# EAGLE design input_output (EAGLE 9.3.0)
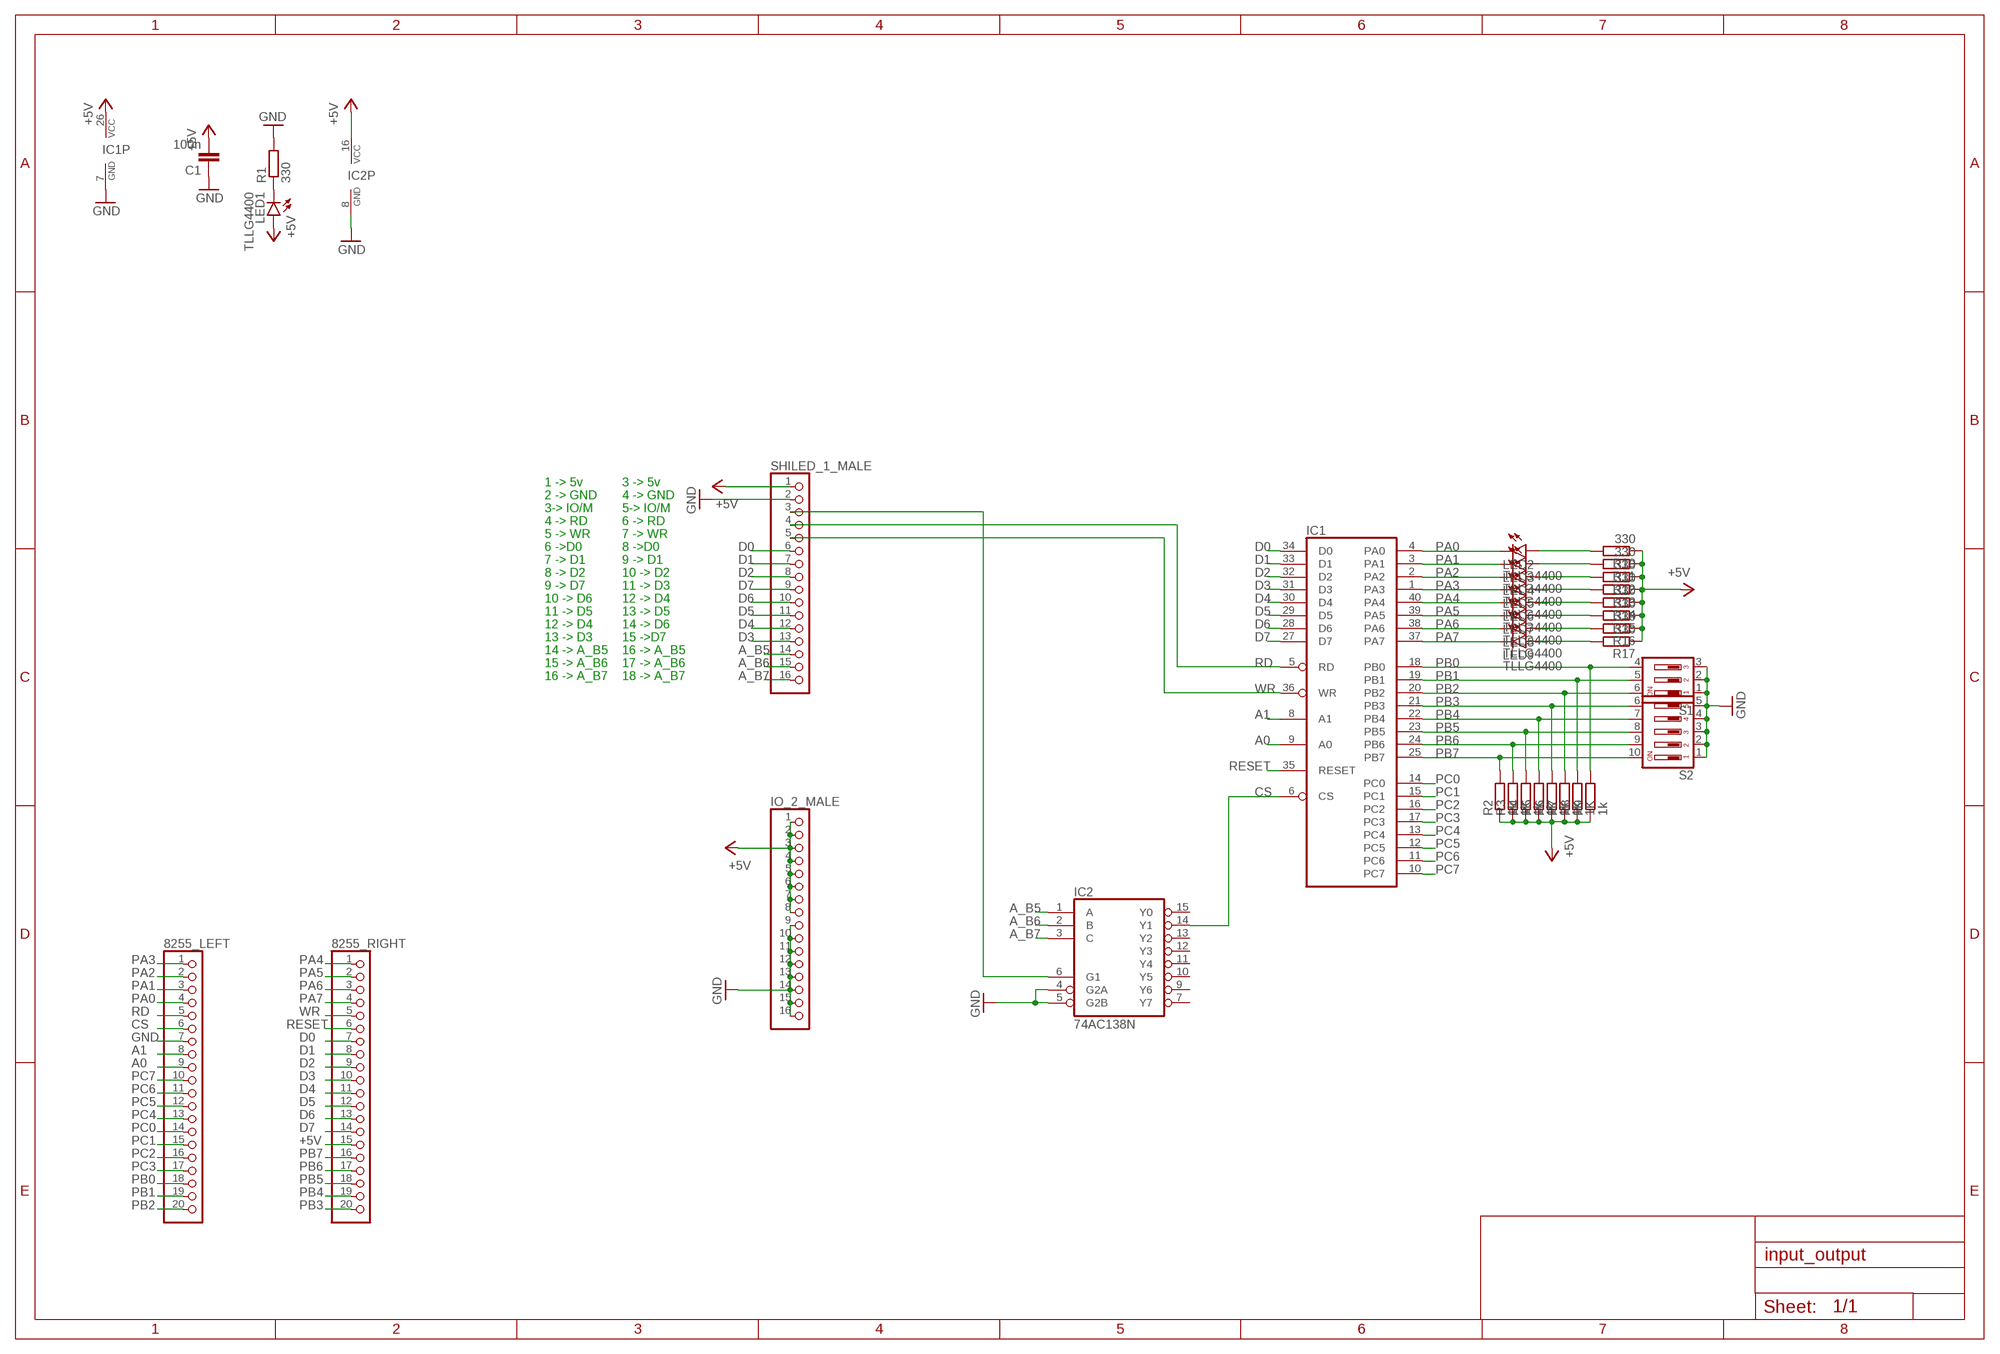
[diagram p0: schematic, sheet 1]

## Parts
8255_LEFT  PINHD-1X20  [1X20]
8255_RIGHT  PINHD-1X20  [1X20]
C1  100n  C-EU025-025X050  [C025-025X050]
IC1  8255A  [DIL40]
IC2  74AC138N  [DIL16]
IO_2_MALE  PINHD-1X16  [1X16]
LED1  TLLG4400  [LED3MM]
LED2  TLLG4400  [LED3MM]
LED3  TLLG4400  [LED3MM]
LED4  TLLG4400  [LED3MM]
LED5  TLLG4400  [LED3MM]
LED6  TLLG4400  [LED3MM]
LED7  TLLG4400  [LED3MM]
LED8  TLLG4400  [LED3MM]
LED9  TLLG4400  [LED3MM]
R1  330  R-EU_0207/7  [0207/7]
R2  1k  R-EU_0207/7  [0207/7]
R3  1k  R-EU_0207/7  [0207/7]
R4  1k  R-EU_0207/7  [0207/7]
R5  1k  R-EU_0207/7  [0207/7]
R6  1k  R-EU_0207/7  [0207/7]
R7  1k  R-EU_0207/7  [0207/7]
R8  1K  R-EU_0207/7  [0207/7]
R9  1k  R-EU_0207/7  [0207/7]
R10  330  R-EU_0207/7  [0207/7]
R11  330  R-EU_0207/7  [0207/7]
R12  330  R-EU_0207/7  [0207/7]
R13  330  R-EU_0207/7  [0207/7]
R14  330  R-EU_0207/7  [0207/7]
R15  330  R-EU_0207/7  [0207/7]
R16  330  R-EU_0207/7  [0207/7]
R17  330  R-EU_0207/7  [0207/7]
S1  DIP03YL  [DIP03YL]
S2  DIP05YL  [DIP05YL]
SHILED_1_MALE  PINHD-1X16  [1X16]

## Nets
+5V: 8255_RIGHT.15 C1.2 IC1.26(VCC) IC2.16(VCC) IO_2_MALE.1 IO_2_MALE.2 IO_2_MALE.3 IO_2_MALE.4 IO_2_MALE.5 IO_2_MALE.6 IO_2_MALE.7 IO_2_MALE.8 LED1.A R2.1 R3.1 R4.1 R5.1 R6.1 R7.1 R8.1 R9.1 R10.1 R11.1 R12.1 R13.1 R14.1 R15.1 R16.1 R17.1 SHILED_1_MALE.1
A0: 8255_LEFT.9 IC1.9(A0)
A1: 8255_LEFT.8 IC1.8(A1)
A_B5: IC2.1(A) SHILED_1_MALE.14
A_B6: IC2.2(B) SHILED_1_MALE.15
A_B7: IC2.3(C) SHILED_1_MALE.16
CS: 8255_LEFT.6 IC1.6(CS) IC2.14(Y1)
D0: 8255_RIGHT.7 IC1.34(D0) SHILED_1_MALE.6
D1: 8255_RIGHT.8 IC1.33(D1) SHILED_1_MALE.7
D2: 8255_RIGHT.9 IC1.32(D2) SHILED_1_MALE.8
D3: 8255_RIGHT.10 IC1.31(D3) SHILED_1_MALE.13
D4: 8255_RIGHT.11 IC1.30(D4) SHILED_1_MALE.12
D5: 8255_RIGHT.12 IC1.29(D5) SHILED_1_MALE.11
D6: 8255_RIGHT.13 IC1.28(D6) SHILED_1_MALE.10
D7: 8255_RIGHT.14 IC1.27(D7) SHILED_1_MALE.9
GND: 8255_LEFT.7 C1.1 IC1.7(GND) IC2.4(G2A) IC2.5(G2B) IC2.8(GND) IO_2_MALE.9 IO_2_MALE.10 IO_2_MALE.11 IO_2_MALE.12 IO_2_MALE.13 IO_2_MALE.14 IO_2_MALE.15 IO_2_MALE.16 R1.2 S1.1 S1.2 S1.3 S2.1 S2.2 S2.3 S2.4 S2.5 SHILED_1_MALE.2
N$1: LED1.K(C) R1.1
N$2: LED2.A R10.2
N$3: LED3.A R11.2
N$4: LED4.A R12.2
N$5: LED5.A R13.2
N$6: LED6.A R14.2
N$7: LED7.A R15.2
N$8: LED8.A R16.2
N$9: LED9.A R17.2
N$10: IC2.6(G1) SHILED_1_MALE.3
PA0: 8255_LEFT.4 IC1.4(PA0) LED2.K(C)
PA1: 8255_LEFT.3 IC1.3(PA1) LED3.K(C)
PA2: 8255_LEFT.2 IC1.2(PA2) LED4.K(C)
PA3: 8255_LEFT.1 IC1.1(PA3) LED5.K(C)
PA4: 8255_RIGHT.1 IC1.40(PA4) LED6.K(C)
PA5: 8255_RIGHT.2 IC1.39(PA5) LED7.K(C)
PA6: 8255_RIGHT.3 IC1.38(PA6) LED8.K(C)
PA7: 8255_RIGHT.4 IC1.37(PA7) LED9.K(C)
PB0: 8255_LEFT.18 IC1.18(PB0) R9.2 S1.4
PB1: 8255_LEFT.19 IC1.19(PB1) R8.2 S1.5
PB2: 8255_LEFT.20 IC1.20(PB2) R7.2 S1.6
PB3: 8255_RIGHT.20 IC1.21(PB3) R6.2 S2.6
PB4: 8255_RIGHT.19 IC1.22(PB4) R5.2 S2.7
PB5: 8255_RIGHT.18 IC1.23(PB5) R4.2 S2.8
PB6: 8255_RIGHT.17 IC1.24(PB6) R3.2 S2.9
PB7: 8255_RIGHT.16 IC1.25(PB7) R2.2 S2.10
PC0: 8255_LEFT.14 IC1.14(PC0)
PC1: 8255_LEFT.15 IC1.15(PC1)
PC2: 8255_LEFT.16 IC1.16(PC2)
PC3: 8255_LEFT.17 IC1.17(PC3)
PC4: 8255_LEFT.13 IC1.13(PC4)
PC5: 8255_LEFT.12 IC1.12(PC5)
PC6: 8255_LEFT.11 IC1.11(PC6)
PC7: 8255_LEFT.10 IC1.10(PC7)
RD: 8255_LEFT.5 IC1.5(RD) SHILED_1_MALE.4
RESET: 8255_RIGHT.6 IC1.35(RESET)
WR: 8255_RIGHT.5 IC1.36(WR) SHILED_1_MALE.5
Unconnected: IC2.7(Y7) IC2.9(Y6) IC2.10(Y5) IC2.11(Y4) IC2.12(Y3) IC2.13(Y2) IC2.15(Y0)

## Notes on the sheet
- 1 -> 5v | 3 -> 5v
- 2 -> GND | 4 -> GND
- 3-> IO/M | 5-> IO/M
- 4 -> RD | 6 -> RD
- 5 -> WR | 7 -> WR
- 6 ->D0 | 8 ->D0
- 7 -> D1 | 9 -> D1
- 8 -> D2 | 10 -> D2
- 9 -> D7 | 11 -> D3
- 10 -> D6 | 12 -> D4
- 11 -> D5 | 13 -> D5
- 12 -> D4 | 14 -> D6
- 13 -> D3 | 15 ->D7
- 14 -> A_B5 | 16 -> A_B5
- 15 -> A_B6 | 17 -> A_B6
- 16 -> A_B7 | 18 -> A_B7

## Library data of the parts
8255_LEFT 8255_RIGHT = pinhead:PINHD-1X20: PIN HEADER
C1 = rcl:C-EU: CAPACITOR, European symbol; SPICEPREFIX: C
IC1 = micro-intel:8255A: MICROCOMPUTER/PERIPHERAL DEVICE; OC_FARNELL: unknown; OC_NEWARK: unknown
IC2 = 74xx-eu:74*138: 3-line to 8-line DECODER/DEMULTIPLEXER
IO_2_MALE SHILED_1_MALE = pinhead:PINHD-1X16: PIN HEADER
LED1-LED9 = led:TLLG4400: Low Current (2mA) LED 3 mm Tinted Diffused Package color GREEN Source: Data sheet <http://www.farnell.com/datasheets/391098.pdf>; MF: VISHAY SEMICONDUCTOR; OC_FARNELL: 1612435
R1-R17 = rcl:R-EU_: RESISTOR, European symbol; SPICEPREFIX: R
S1 = switch-dil:DIP03YL: DIL/CODE SWITCH; OC_FARNELL: unknown; OC_NEWARK: unknown
S2 = switch-dil:DIP05YL: DIL/CODE SWITCH; OC_FARNELL: unknown; OC_NEWARK: unknown

## Net classes
0 default: width 0.6 mm, drill 0.8 mm, clearance 0.5 mm

## Board
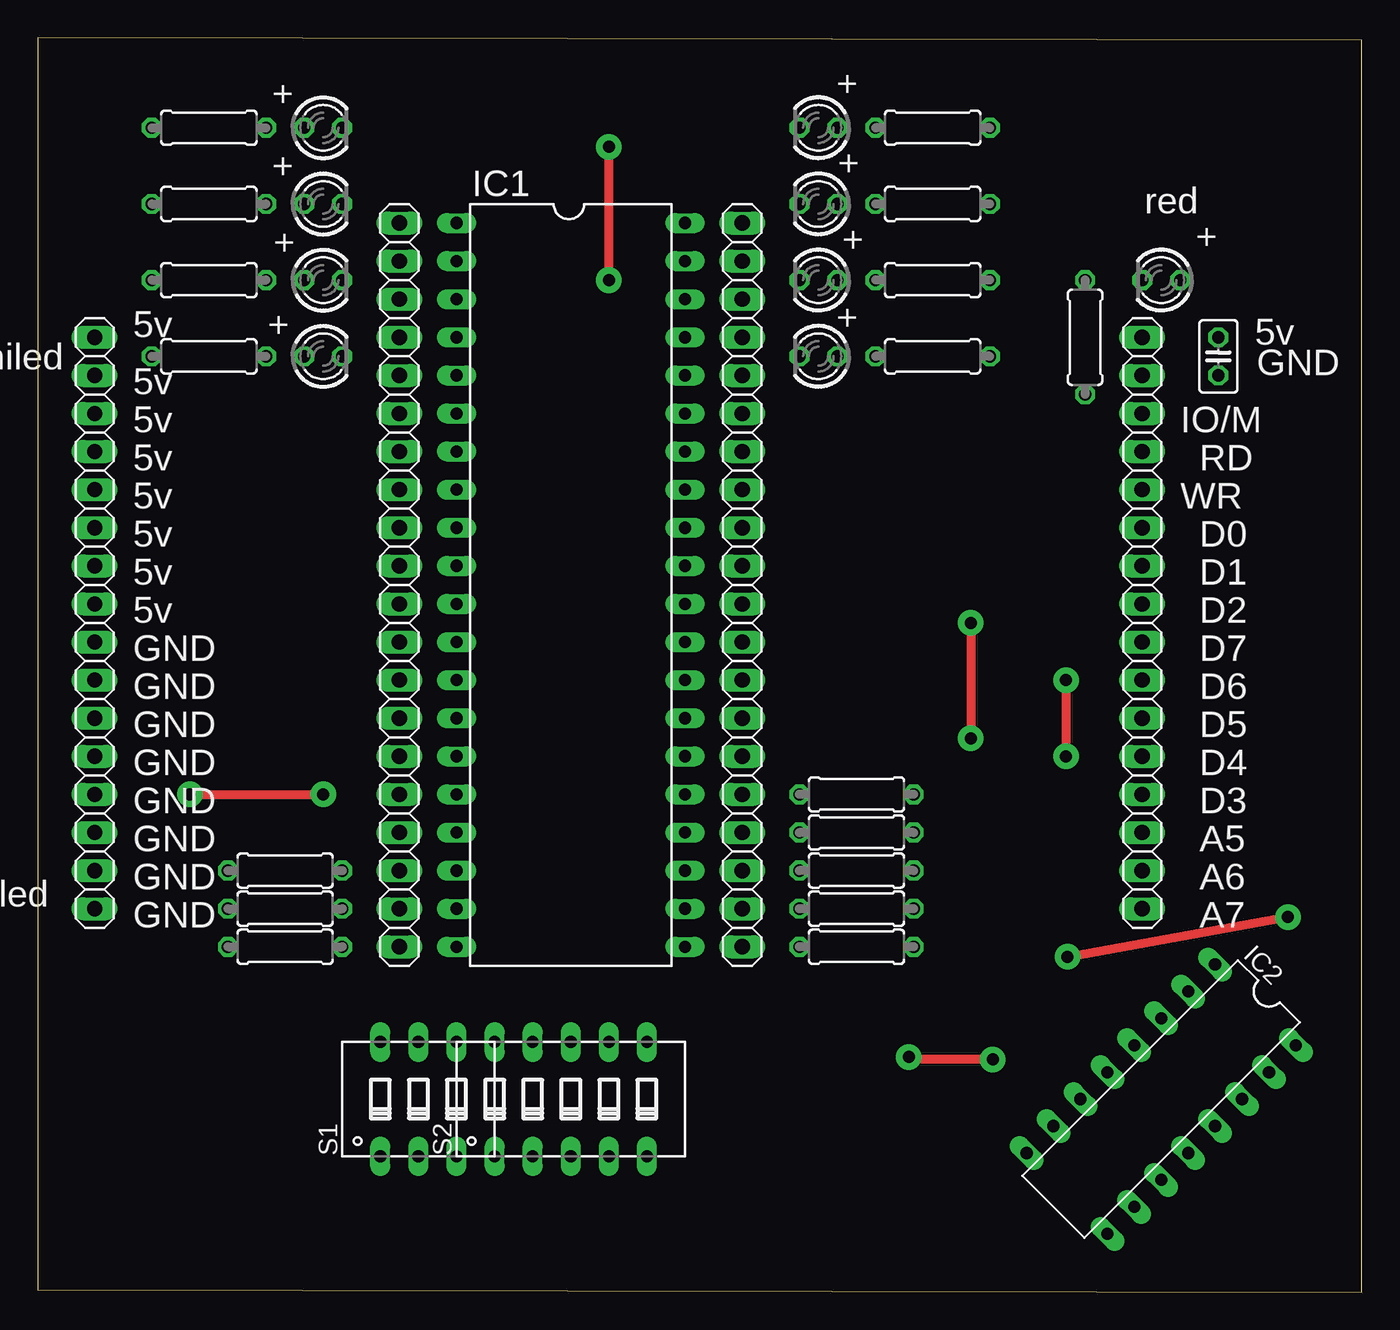
[diagram p1: board, top side]
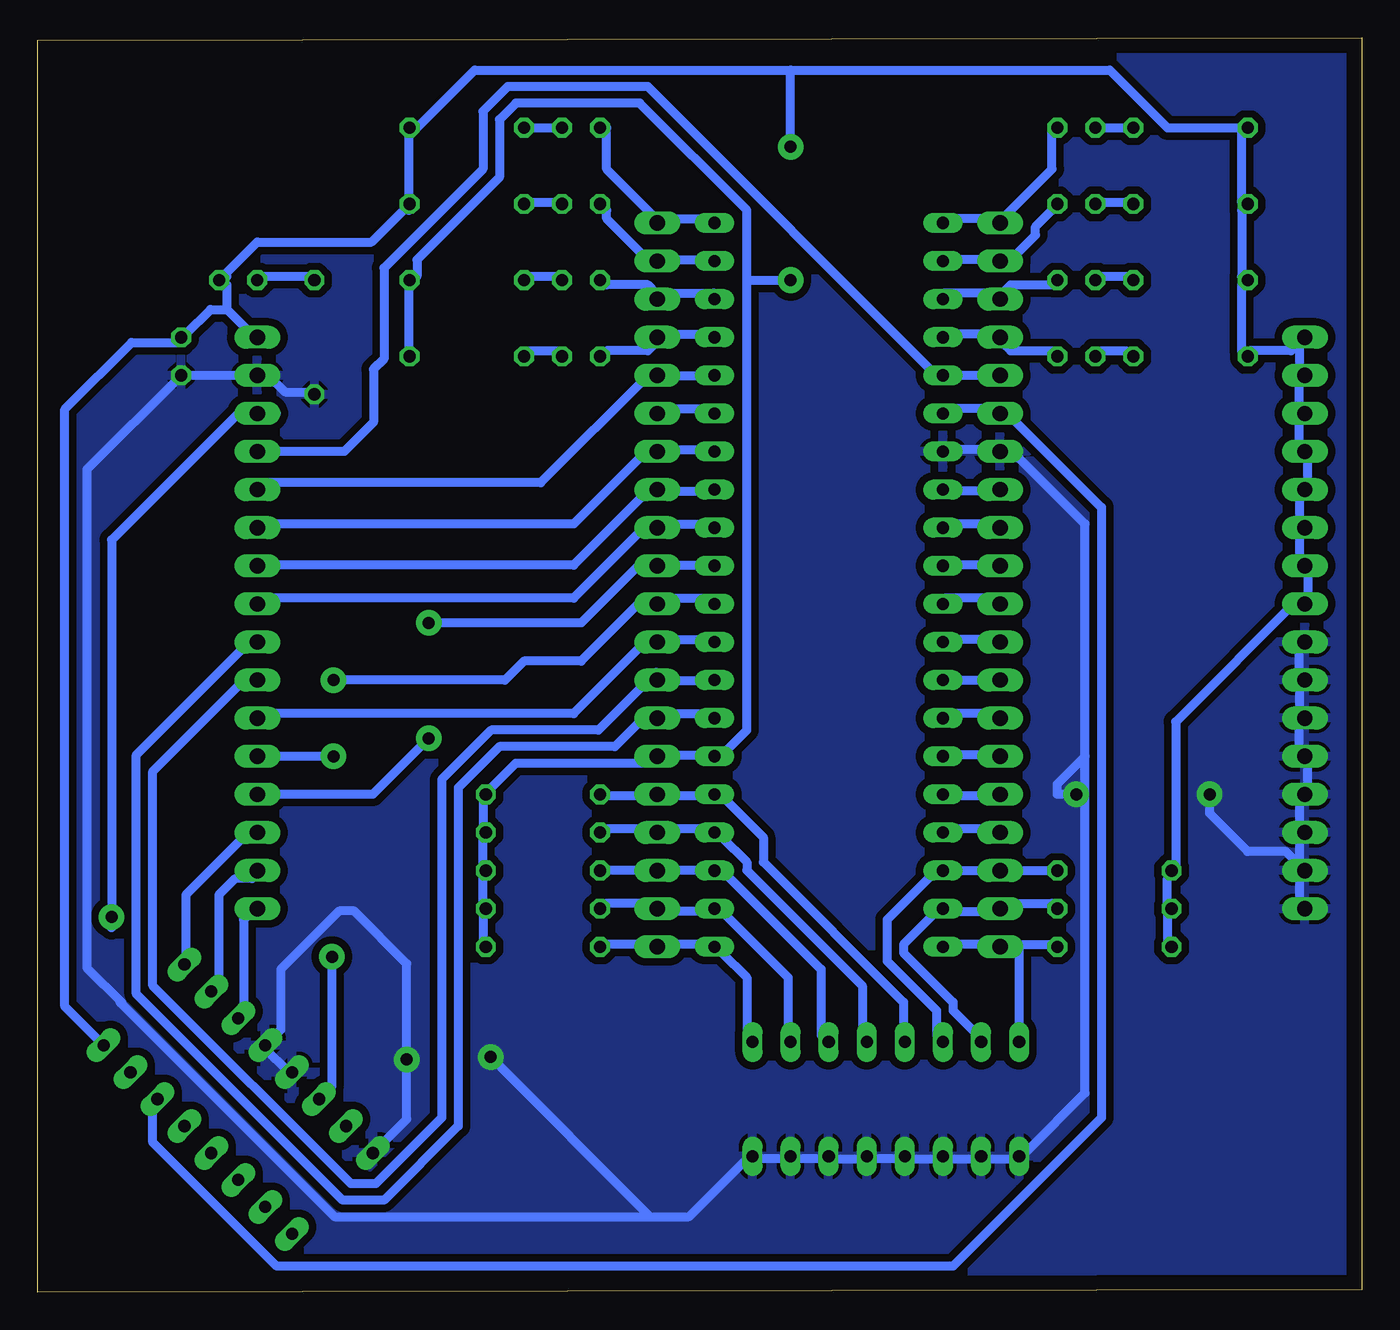
[diagram p2: board, bottom side, seen from below]

Size 88.32 x 83.68 mm. Coordinates in mm from the lower left corner, seen from the top.
Outline: 0,0.19 88.32,0 88.32,83.49 0,83.68 0,0.19
Copper layers (1*16): Top 0.035mm / dielectric 1.5mm / Bottom 0.035mm
Design rules "default": minimum track width 6mil, minimum drill 0.35mm, track to track 6mil, track to pad 6mil, pad to pad 6mil, via to via 6mil, smd to smd 6mil, copper to edge 40mil, drill to drill 6mil, minimum pad ring 10mil, minimum via ring 8mil, stop-mask expansion 4mil, vias tented up to drill 0mil, thermal gap 10mil

### Footprints (pad centres in the part's own frame; a part is rotated, then mirrored left to right if it is on the bottom)
1X20 = drill 1.016 long: 1 -24.13,0; 2 -21.59,0; 3 -19.05,0; 4 -16.51,0; 5 -13.97,0; 6 -11.43,0; 7 -8.89,0; 8 -6.35,0; 9 -3.81,0; 10 -1.27,0; 11 1.27,0; 12 3.81,0; 13 6.35,0; 14 8.89,0; 15 11.43,0; 16 13.97,0; 17 16.51,0; 18 19.05,0; 19 21.59,0; 20 24.13,0
C025-025X050 = drill 0.813 octagon: 1 -1.27,0; 2 1.27,0
DIL40 = drill 0.813 long: 1 -24.13,-7.62; 2 -21.59,-7.62; 3 -19.05,-7.62; 4 -16.51,-7.62; 5 -13.97,-7.62; 6 -11.43,-7.62; 7 -8.89,-7.62; 8 -6.35,-7.62; 9 -3.81,-7.62; 10 -1.27,-7.62; 11 1.27,-7.62; 12 3.81,-7.62; 13 6.35,-7.62; 14 8.89,-7.62; 15 11.43,-7.62; 16 13.97,-7.62; 17 16.51,-7.62; 18 19.05,-7.62; 19 21.59,-7.62; 20 24.13,-7.62; 21 24.13,7.62; 22 21.59,7.62; 23 19.05,7.62; 24 16.51,7.62; 25 13.97,7.62; 26 11.43,7.62; 27 8.89,7.62; 28 6.35,7.62; 29 3.81,7.62; 30 1.27,7.62; 31 -1.27,7.62; 32 -3.81,7.62; 33 -6.35,7.62; 34 -8.89,7.62; 35 -11.43,7.62; 36 -13.97,7.62; 37 -16.51,7.62; 38 -19.05,7.62; 39 -21.59,7.62; 40 -24.13,7.62
DIL16 = drill 0.813 long: 1 -8.89,-3.81; 2 -6.35,-3.81; 3 -3.81,-3.81; 4 -1.27,-3.81; 5 1.27,-3.81; 6 3.81,-3.81; 7 6.35,-3.81; 8 8.89,-3.81; 9 8.89,3.81; 10 6.35,3.81; 11 3.81,3.81; 12 1.27,3.81; 13 -1.27,3.81; 14 -3.81,3.81; 15 -6.35,3.81; 16 -8.89,3.81
1X16 = drill 1.016 long: 1 -19.05,0; 2 -16.51,0; 3 -13.97,0; 4 -11.43,0; 5 -8.89,0; 6 -6.35,0; 7 -3.81,0; 8 -1.27,0; 9 1.27,0; 10 3.81,0; 11 6.35,0; 12 8.89,0; 13 11.43,0; 14 13.97,0; 15 16.51,0; 16 19.05,0
LED3MM = drill 0.813 octagon: A -1.27,0; K 1.27,0
0207/7 = drill 0.813 octagon: 1 -3.81,0; 2 3.81,0
DIP03YL = drill 0.813 long: 1 -2.54,-3.81; 2 0,-3.81; 3 2.54,-3.81; 4 2.54,3.81; 5 0,3.81; 6 -2.54,3.81
DIP05YL = drill 0.813 long: 1 -5.08,-3.81; 2 -2.54,-3.81; 3 0,-3.81; 4 2.54,-3.81; 5 5.08,-3.81; 6 5.08,3.81; 7 2.54,3.81; 8 0,3.81; 9 -2.54,3.81; 10 -5.08,3.81

### Placement (x,y rotation side)
8255_LEFT  24.13,47.18 270 top
8255_RIGHT  46.99,47.18 270 top
C1  78.74,62.42 90 top
IC1  35.56,47.18 270 top
IC2  74.93,12.89 225 top
IO_2_MALE  3.81,44.64 270 top
LED1  74.93,67.5 180 top
LED2  19.05,62.42 0 top
LED3  19.05,67.5 0 top
LED4  19.05,72.58 0 top
LED5  19.05,77.66 0 top
LED6  52.07,77.66 180 top
LED7  52.07,72.58 180 top
LED8  52.07,67.5 180 top
LED9  52.07,62.42 180 top
R1  69.85,63.69 270 top
R2  54.61,33.21 180 top
R3  54.61,30.67 180 top
R4  54.61,28.13 180 top
R5  54.61,25.59 180 top
R6  54.61,23.05 180 top
R7  16.51,23.05 0 top
R8  16.51,25.59 0 top
R9  16.51,28.13 0 top
R10  11.43,62.42 0 top
R11  11.43,67.5 0 top
R12  11.43,72.58 0 top
R13  11.43,77.66 0 top
R14  59.69,77.66 180 top
R15  59.69,72.58 180 top
R16  59.69,67.5 180 top
R17  59.69,62.42 180 top
S1  25.4,12.89 0 top
S2  35.56,12.89 0 top
SHILED_1_MALE  73.66,44.64 270 top

### Tracks (layer width: path | path; a pad name or v marks a point on that pad's centre or on a via)
+5V  (via drill 0.8 pad 1.7)
  Top 0.6: v38.1,67.5 v38.1,76.39
  Bottom 0.6: 8.02,77.65 8.02,72.7 R12.1 8.02,72.15 8.02,67.75 R11.1 8.02,67.2 8.02,62.8 R10.1 7.47,62.8 4.72,62.8 4.17,63.35 | 4.17,63.35 4.17,61.15 | 4.17,63.35 IO_2_MALE.1 | R7.1 12.97,23.2 12.97,25.4 R8.1 12.97,25.95 12.97,27.6 R9.1 12.42,28.15 12.42,38.05 4.17,46.3 IO_2_MALE.8 3.62,46.3 3.62,47.95 IO_2_MALE.7 4.17,48.5 4.17,50.7 IO_2_MALE.6 4.17,51.25 4.17,53.45 IO_2_MALE.5 3.62,54 3.62,55.65 IO_2_MALE.4 4.17,56.2 4.17,58.4 IO_2_MALE.3 4.17,58.95 4.17,61.15 | 4.17,61.15 IO_2_MALE.2 | R15.1 63.57,72.7 63.57,77.65 R14.1 63.02,77.65 59.17,81.5 38.1,81.5 | 75.67,65.55 75.67,67.2 LED1.A | 75.67,65.55 74.02,63.9 SHILED_1_MALE.1 | 63.57,72.15 R15.1 | 75.67,67.75 LED1.A | 83.92,16.6 IC2.16 86.5,19.07 86.5,58.9 82.05,63.35 78.97,63.35 C1.2 78.42,63.9 76.77,65.55 75.67,65.55 | 8.02,77.65 12.97,77.65 16.82,81.5 38.1,81.5 | 8.02,77.65 R13.1 | R17.1 63.57,62.8 63.57,67.2 R16.1 63.02,67.75 63.02,68.85 57.52,74.35 57.52,78.2 56.42,79.3 48.17,79.3 41.02,72.15 41.02,67.5 | R6.1 58.62,23.2 58.62,25.4 R5.1 58.62,25.95 58.62,27.6 R4.1 58.62,28.15 58.62,30.35 R3.1 58.62,30.9 58.62,33.1 R2.1 58.07,33.65 56.42,35.3 47.07,35.3 8255_RIGHT.15 46.52,35.85 43.22,35.85 IC1.26 42.67,35.85 41.02,37.5 41.02,67.5 | LED1.A 73.66,70.04 66.04,70.04 R15.1 | 41.02,67.5 v38.1,67.5 | v38.1,76.39 38.1,81.5
A0
  Bottom 0.6: IC1.9 27.82,51.25 24.52,51.25 8255_LEFT.9
A1
  Bottom 0.6: IC1.8 27.82,53.45 24.52,53.45 8255_LEFT.8
A_B5
  Bottom 0.6: IC2.1 78.42,22.1 78.42,26.5 74.02,30.9 SHILED_1_MALE.14
A_B6
  Bottom 0.6: IC2.2 76.22,20.45 76.22,26.5 75.12,27.6 74.02,27.6 SHILED_1_MALE.15
A_B7
  Bottom 0.6: IC2.3 74.57,18.8 74.57,24.85 74.02,25.4 SHILED_1_MALE.16
CS
  Bottom 0.6: IC1.6 27.82,58.95 24.52,58.95 8255_LEFT.6 23.97,58.95 17.37,52.35 17.37,11.65 27.27,1.75 72.37,1.75 80.62,10 80.62,12.75 IC2.14
D0
  Bottom 0.6: IC1.34 43.22,56.2 46.52,56.2 8255_RIGHT.7 47.07,55.65 48.17,55.65 52.57,51.25 73.47,51.25 SHILED_1_MALE.6
D1
  Bottom 0.6: IC1.33 43.22,53.45 46.52,53.45 8255_RIGHT.8 47.07,54 52.57,48.5 73.47,48.5 SHILED_1_MALE.7
D2
  Bottom 0.6: IC1.32 43.22,51.25 46.52,51.25 8255_RIGHT.9 47.07,50.7 48.17,50.7 52.57,46.3 73.47,46.3 SHILED_1_MALE.8
D3  (via drill 0.8 pad 1.7)
  Top 0.6: v62.23,44.64 v62.23,36.95
  Bottom 0.6: IC1.31 43.22,48.5 46.52,48.5 8255_RIGHT.10 48.26,48.45 52.07,44.64 v62.23,44.64 | v62.23,36.95 65.97,33.21 SHILED_1_MALE.13
D4  (via drill 0.8 pad 1.7)
  Top 0.6: v68.58,40.83 v68.58,35.75
  Bottom 0.6: IC1.30 43.22,46.3 46.52,46.3 8255_RIGHT.11 48.26,45.91 52.07,42.1 55.88,42.1 57.15,40.83 v68.58,40.83 | v68.58,35.75 SHILED_1_MALE.12
D5
  Bottom 0.6: IC1.29 43.22,43.55 46.52,43.55 8255_RIGHT.12 47.07,43 48.17,43 52.57,38.6 73.47,38.6 SHILED_1_MALE.11
D6
  Bottom 0.6: IC1.28 43.22,40.8 46.52,40.8 8255_RIGHT.13 47.07,41.35 50.92,37.5 58.07,37.5 61.37,34.2 61.37,11.65 65.77,7.25 67.42,7.25 80.62,20.45 80.62,34.75 74.57,40.8 74.02,40.8 SHILED_1_MALE.10
D7
  Bottom 0.6: IC1.27 43.22,38.6 46.52,38.6 8255_RIGHT.14 47.07,38.05 48.17,38.05 49.82,36.4 57.52,36.4 60.27,33.65 60.27,11.1 65.22,6.15 67.97,6.15 81.72,19.9 81.72,35.85 74.57,43 74.02,43 SHILED_1_MALE.9
GND  (via drill 0.8 pad 1.7)
  Top 0.6: v10.16,33.21 v19.05,33.21 | v63.69,15.54 58.26,15.54 v58.1,15.7
  Bottom 0.6: IO_2_MALE.9 4.17,43 4.17,41.35 IO_2_MALE.10 4.17,40.8 4.17,38.6 IO_2_MALE.11 4.17,38.05 4.17,35.85 IO_2_MALE.12 3.62,35.3 3.62,33.65 IO_2_MALE.13 4.17,33.1 4.17,30.9 IO_2_MALE.14 4.17,30.35 4.17,28.15 IO_2_MALE.15 | IO_2_MALE.16 4.17,25.95 4.17,27.6 IO_2_MALE.15 | 71.27,14.95 IC2.5 71.82,14.95 72.92,16.05 IC2.4 72.1,17.52 72.1,21.54 68.21,25.43 67.19,25.43 63.69,21.93 v63.69,15.54 63.69,11.56 IC2.8 | R1.2 70.17,60.05 71.82,60.05 72.92,61.15 SHILED_1_MALE.2 C1.1 | IC1.7 27.82,56.2 24.52,56.2 8255_LEFT.7 23.97,55.65 22.87,55.65 18.47,51.25 18.47,35.75 | 18.47,35.75 18.47,13.3 22.32,9.45 S1.1 22.87,8.9 25.07,8.9 S1.2 25.62,8.9 27.82,8.9 S1.3 28.37,8.9 30.02,8.9 S2.1 30.57,8.9 32.77,8.9 S2.2 33.32,8.9 35.52,8.9 S2.3 36.07,8.9 37.72,8.9 S2.4 38.27,8.9 40.47,8.9 S2.5 41.02,8.9 44.87,5.05 47.46,5.05 | 82.82,19.35 82.68,19.21 | 82.68,19.21 68.52,5.05 47.46,5.05 | 78.97,61.15 C1.1 | IO_2_MALE.15 5.08,29.4 7.62,29.4 10.16,31.94 v10.16,33.21 | 18.47,35.75 20.32,33.9 20.32,33.21 v19.05,33.21 | 82.68,19.21 82.68,19.31 85.02,21.65 85.02,54.87 C1.1 | v58.1,15.7 47.46,5.05
  pour Bottom: -0.22,83.78 -0.22,0.63 -0.61,0.24 87.83,0.24 88.61,1.02 88.61,83.58 88.8,83.78
N$1
  Bottom 0.6: R1.1 70.17,67.75 73.47,67.75 LED1.K
N$2
  Bottom 0.6: R10.2 15.72,62.8 17.37,62.8 LED2.A
N$3
  Bottom 0.6: R11.2 15.72,67.75 17.37,67.75 LED3.A
N$4
  Bottom 0.6: R12.2 15.72,72.7 17.37,72.7 LED4.A
N$5
  Bottom 0.6: R13.2 15.72,77.65 17.37,77.65 LED5.A
N$6
  Bottom 0.6: LED6.A 53.67,77.65 R14.2
N$7
  Bottom 0.6: LED7.A 53.67,72.7 55.87,72.7 R15.2
N$8
  Bottom 0.6: LED8.A 53.67,67.75 55.87,67.75 R16.2
N$9
  Bottom 0.6: LED9.A 53.67,62.8 55.87,62.8 R17.2
N$10  (via drill 0.8 pad 1.7)
  Top 0.6: v68.67,22.39 v83.37,25.04
  Bottom 0.6: 72.39,58.61 SHILED_1_MALE.3 74.93,58.61 83.37,50.17 v83.37,25.04 83.37,24.32 | IC2.6 68.67,13.76 v68.67,22.39
PA0
  Bottom 0.6: LED2.K 20.67,62.8 23.42,62.8 23.97,63.35 8255_LEFT.4 24.52,63.9 27.82,63.9 IC1.4
PA1
  Bottom 0.6: LED3.K 20.67,67.2 23.42,67.2 23.97,66.65 8255_LEFT.3 24.52,66.65 27.82,66.65 IC1.3
PA2
  Bottom 0.6: LED4.K 20.67,72.15 21.77,71.05 21.77,70.5 23.97,68.3 8255_LEFT.2 24.52,68.85 27.82,68.85 IC1.2
PA3
  Bottom 0.6: LED5.K 20.67,77.65 20.67,74.9 23.97,71.6 8255_LEFT.1 24.52,71.6 27.82,71.6 IC1.1
PA4
  Bottom 0.6: IC1.40 43.22,71.6 46.52,71.6 8255_RIGHT.1 47.07,71.6 50.37,74.9 50.37,77.65 LED6.K
PA5
  Bottom 0.6: IC1.39 43.22,68.85 46.52,68.85 8255_RIGHT.2 47.07,68.3 50.37,71.6 50.37,72.15 LED7.K
PA6
  Bottom 0.6: IC1.38 43.22,66.65 46.52,66.65 8255_RIGHT.3 47.07,66.65 47.62,67.2 50.37,67.2 LED8.K
PA7
  Bottom 0.6: IC1.37 43.22,63.9 46.52,63.9 8255_RIGHT.4 47.07,63.35 47.62,62.8 50.37,62.8 LED9.K
PB0
  Bottom 0.6: R9.2 20.67,28.15 23.97,28.15 8255_LEFT.18 24.52,28.15 27.82,28.15 IC1.18 28.37,28.15 31.67,24.85 31.67,22.1 28.37,18.8 28.37,17.15 S1.4
PB1
  Bottom 0.6: R8.2 20.67,25.95 23.97,25.95 8255_LEFT.19 24.52,25.4 27.82,25.4 IC1.19 28.37,25.4 30.57,23.2 30.57,22.65 27.27,19.35 27.27,18.8 25.62,17.15 S1.5
PB2
  Bottom 0.6: 22.87,23.2 23.97,23.2 8255_LEFT.20 | 22.87,23.2 20.67,23.2 R7.2 | 22.87,23.2 22.87,17.15 S1.6 | 22.87,23.2 8255_LEFT.20 | IC1.20 27.82,23.2 24.52,23.2 8255_LEFT.20
PB3
  Bottom 0.6: R6.2 50.37,23.2 47.07,23.2 8255_RIGHT.20 46.52,23.2 43.22,23.2 IC1.21 42.67,22.65 41.02,21 41.02,17.15 S2.6
PB4
  Bottom 0.6: R5.2 50.37,25.95 47.07,25.95 8255_RIGHT.19 46.52,25.4 43.22,25.4 IC1.22 42.67,25.4 38.27,21 38.27,17.15 S2.7
PB5
  Bottom 0.6: R4.2 50.37,28.15 47.07,28.15 8255_RIGHT.18 46.52,28.15 43.22,28.15 IC1.23 42.67,28.15 36.07,21.55 36.07,17.15 S2.8
PB6
  Bottom 0.6: R3.2 50.37,30.9 47.07,30.9 8255_RIGHT.17 46.52,30.9 43.22,30.9 IC1.24 42.67,30.35 41.02,28.7 41.02,28.15 33.32,20.45 33.32,17.15 S2.9
PB7
  Bottom 0.6: R2.2 50.37,33.1 47.07,33.1 8255_RIGHT.16 46.52,33.1 43.22,33.1 IC1.25 42.67,33.1 39.92,30.35 39.92,28.7 30.57,19.35 30.57,17.15 S2.10
PC0
  Bottom 0.6: IC1.14 27.82,38.6 24.52,38.6 8255_LEFT.14
PC1
  Bottom 0.6: IC1.15 27.82,35.85 24.52,35.85 8255_LEFT.15
PC2
  Bottom 0.6: IC1.16 27.82,33.1 24.52,33.1 8255_LEFT.16
PC3
  Bottom 0.6: IC1.17 27.82,30.9 24.52,30.9 8255_LEFT.17
PC4
  Bottom 0.6: IC1.13 27.82,40.8 24.52,40.8 8255_LEFT.13
PC5
  Bottom 0.6: IC1.12 27.82,43.55 24.52,43.55 8255_LEFT.12
PC6
  Bottom 0.6: IC1.11 27.82,46.3 24.52,46.3 8255_LEFT.11
PC7
  Bottom 0.6: IC1.10 27.82,48.5 24.52,48.5 8255_LEFT.10
RD
  Bottom 0.6: 8255_LEFT.5 IC1.5 28.37,61.15 47.62,80.4 56.97,80.4 58.62,78.75 58.62,74.9 65.22,68.3 65.22,62.25 65.91,61.57 65.91,58.03 67.87,56.07 SHILED_1_MALE.4 73.47,56.2
RESET
  Bottom 0.6: IC1.35 43.22,58.95 46.52,58.95 8255_RIGHT.6
WR
  Bottom 0.6: IC1.36 8255_RIGHT.5 47.62,61.15 54.77,54 73.47,54 SHILED_1_MALE.5

### Text on the board
tNames: + | + | + | + | red | + | + | + | 5v | + | 5v | + | 4-Header-female_shiled | GND | 5v | 5v | IO/M | 5v | RD | 5v | WR | 5v | D0 | 5v | D1 | 8-header_male | 5v | D2 | GND | D7 | GND | D6 | GND | D5 | GND | D4 | GND | D3 | GND | A5 | GND | A6 | 4-Header-female_shiled | GND | A7